# Altium schematic sheet BEEP.SchDoc
size A4
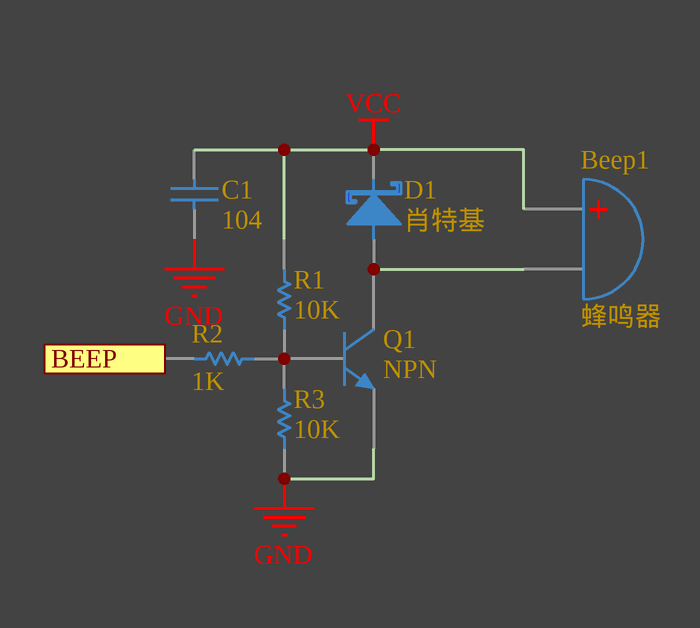
[diagram p0: BEEP.SchDoc]

## Parts
Beep1  蜂鸣器  [Beep-5.0*5.0]
C1  104  [C0402]
D1  肖特基  [SOD-123F]
Q1  NPN  [SOT-23]
R1  10K  [R0402]
R2  1K  [R0402]
R3  10K  [R0402]

## Ports
BEEP (in)

## Nets
GND: C1.1 Q1.2(E) R3.1
VCC: Beep1.1(A) C1.2 D1.2(K) R1.2
BEEP: R2.2 ; port BEEP
NetBeep1_2: Beep1.2(B) D1.1(A) Q1.3(C)
NetQ1_1: Q1.1(B) R1.1 R2.1 R3.2

## Library data of the parts
C1 = 电容: Capacitor; Value: 22pF; Published: 8-Jun-2000; LatestRevisionDate: 17-Jul-2002; LatestRevisionNote: Re-released for DXP Platform.; PackageReference: RAD-0.3; Publisher: Altium Limited; PackageDescription: Radial Cap, Thru-Hole; 2 Leads; 0.3 in Pin Spacing
D1 = 肖特基: Schottky Diode
Q1 = NPN: NPN Bipolar Transistor; Published: 8-Jun-2000; LatestRevisionDate: 17-Jul-2002; LatestRevisionNote: Re-released for DXP Platform.; PackageReference: TO-226-AA; Publisher: Altium Limited; PackageDescription: TO, Flat Index; 3 In-Line, Axial Leads; Body Dia. 4.8mm; Leads 0.55 x 0.51 mm (max); Code_JEDEC: TO-226-AA
R1-R3 = 电阻: Resistor; Value: 150R; Published: 8-Jun-2000; LatestRevisionDate: 17-Jul-2002; LatestRevisionNote: Re-released for DXP Platform.; PackageReference: AXIAL-0.3; Publisher: Altium Limited; PackageDescription: Axial Device, Thru-Hole; 2 Leads; 0.3 in Pin Spacing